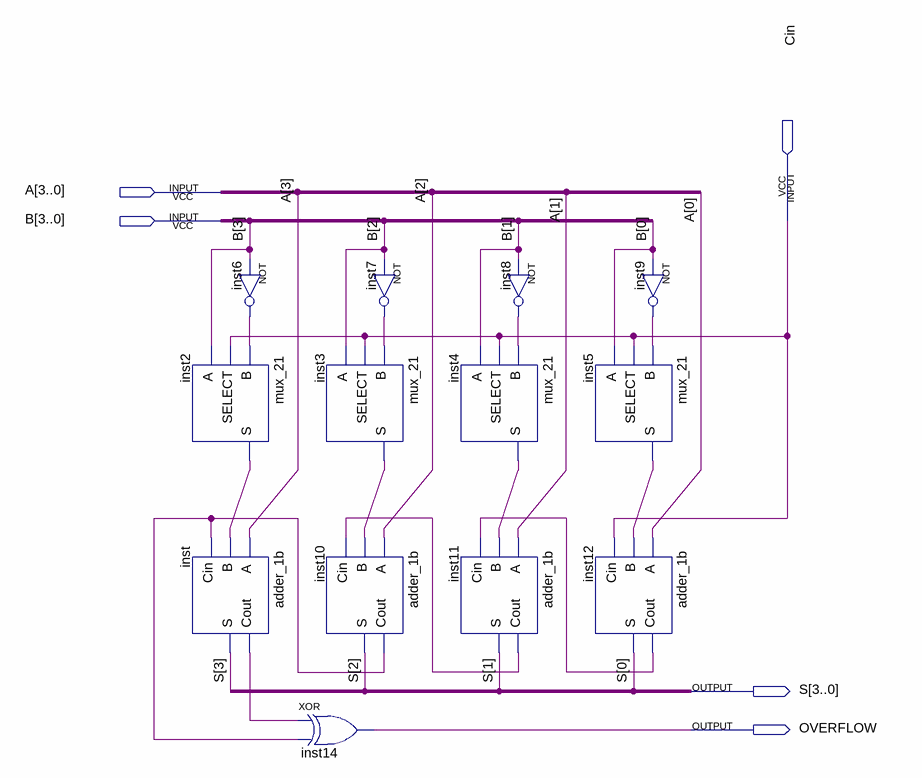
[diagram p0: schematic sheet]
// Quartus schematic adder_4b.bdf as structural Verilog: 13 symbols, 5 pins
module adder_4b (
  input  [3:0] A,
  input  [3:0] B,
  input  Cin,
  output [3:0] S,
  output OVERFLOW
);

  wire inst2_s, inst3_s, inst4_s, inst5_s, inst6_out, inst7_out, inst8_out, inst9_out, inst10_cout,
       inst11_cout, inst12_cout, inst_cout;

  mux_21 inst2 (.B(inst6_out), .SELECT(Cin), .A(B[3]), .S(inst2_s));
  adder_1b inst (.A(A[3]), .B(inst2_s), .Cin(inst10_cout), .Cout(inst_cout), .S(S[3]));
  not inst6 (inst6_out, B[3]);
  mux_21 inst3 (.B(inst7_out), .SELECT(Cin), .A(B[2]), .S(inst3_s));
  adder_1b inst10 (.A(A[2]), .B(inst3_s), .Cin(inst11_cout), .Cout(inst10_cout), .S(S[2]));
  xor inst14 (OVERFLOW, inst_cout, inst10_cout);
  not inst7 (inst7_out, B[2]);
  mux_21 inst4 (.B(inst8_out), .SELECT(Cin), .A(B[1]), .S(inst4_s));
  adder_1b inst11 (.A(A[1]), .B(inst4_s), .Cin(inst12_cout), .Cout(inst11_cout), .S(S[1]));
  not inst8 (inst8_out, B[1]);
  not inst9 (inst9_out, B[0]);
  mux_21 inst5 (.B(inst9_out), .SELECT(Cin), .A(B[0]), .S(inst5_s));
  adder_1b inst12 (.A(A[0]), .B(inst5_s), .Cin(Cin), .Cout(inst12_cout), .S(S[0]));
endmodule
